# Altium schematic sheet 3_LEDDRIVERS.SchDoc: SmartHalo - Led (Drivers)
size B; Author: Sébastien Gélinas; Organization: SmartHalo; Address1: 5445 de Gaspé; Address2: Montréal, QC; Address3: Canada; Address4: H2T 3B2; Revision: 1; SheetNumber: 3; SheetTotal: 7
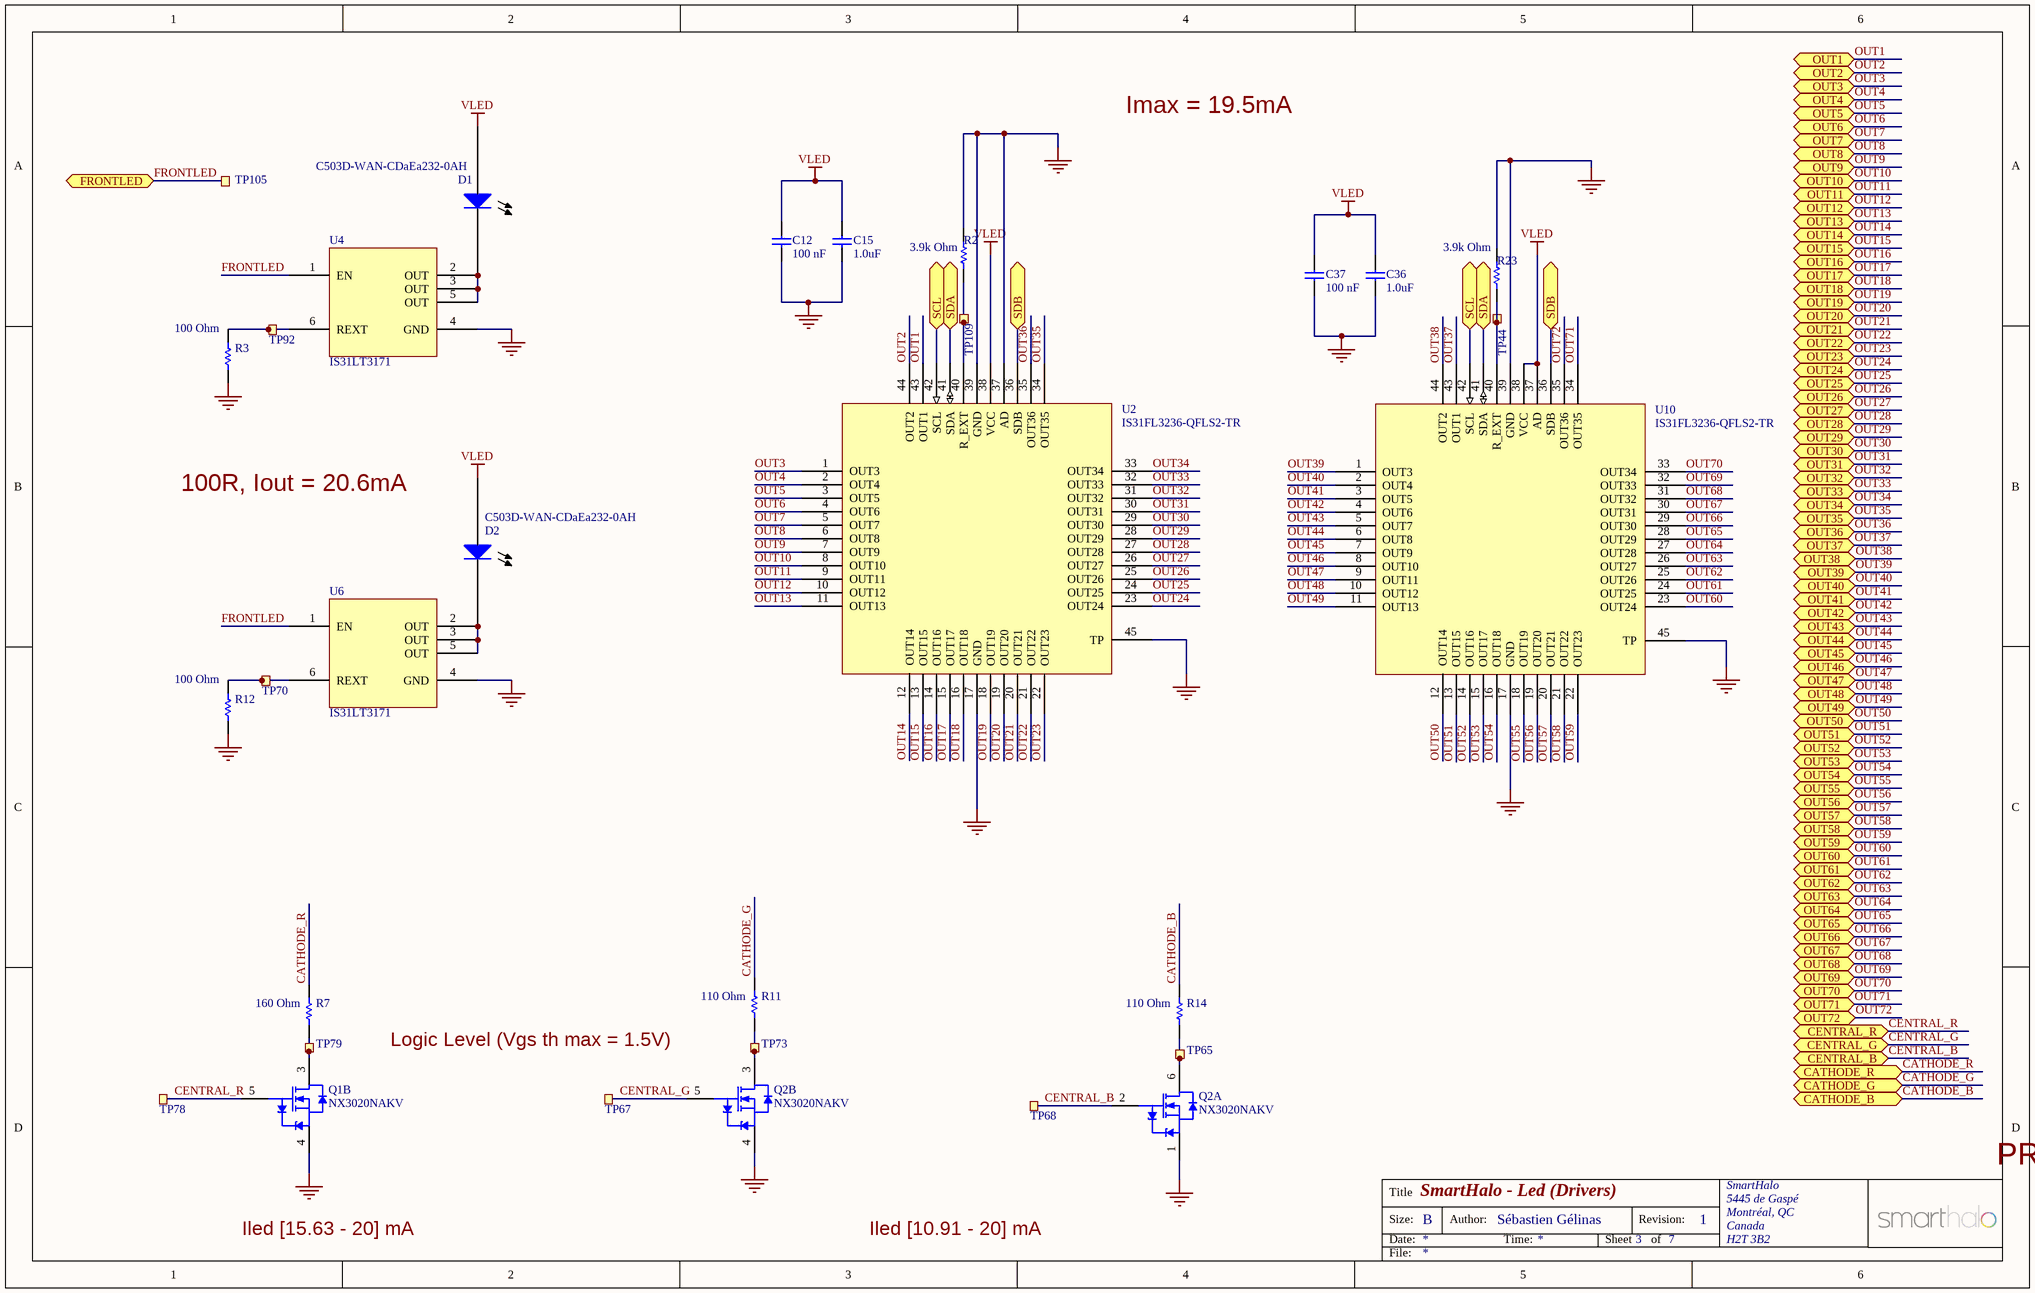
[diagram p0: 3_LEDDRIVERS.SchDoc]

## Parts
C12  100 nF  [Varitron_CAP0402]
C15  1.0uF  [Varitron_CAP0603]
C36  1.0uF  [Varitron_CAP0603]
C37  100 nF  [Varitron_CAP0402]
D1  C503D-WAN-CDaEa232-0AH  [FRONTLED_PADS]
D2  C503D-WAN-CDaEa232-0AH  [FRONTLED_PADS]
Q1  NX3020NAKV  [SOT666]  (part B of 2)
Q2  NX3020NAKV  [SOT666]  (parts A,B of 2)
R2  3.9k Ohm  [Varitron_RES0402]
R3  100 Ohm  [Varitron_RES0402]
R7  160 Ohm  [Varitron_RES0402]
R11  110 Ohm  [Varitron_RES0402]
R12  100 Ohm  [Varitron_RES0402]
R14  110 Ohm  [Varitron_RES0402]
R23  3.9k Ohm  [Varitron_RES0402]
TP44  (no value)  [TESTPAD-TH-35mils]  (no BOM)
TP65  (no value)  [TESTPAD-TH-35mils]  (no BOM)
TP67  (no value)  [TESTPAD-TH-35mils]  (no BOM)
TP68  (no value)  [TESTPAD-TH-35mils]  (no BOM)
TP70  (no value)  [TESTPAD-TH-35mils]  (no BOM)
TP73  (no value)  [TESTPAD-TH-35mils]  (no BOM)
TP78  (no value)  [TESTPAD-TH-35mils]  (no BOM)
TP79  (no value)  [TESTPAD-TH-35mils]  (no BOM)
TP92  (no value)  [TESTPAD-TH-35mils]  (no BOM)
TP105  (no value)  [TESTPAD-TH-35mils]  (no BOM)
TP109  (no value)  [TESTPAD-TH-35mils]  (no BOM)
U2  IS31FL3236-QFLS2-TR  [QFN-44]
U4  IS31LT3171  [SOT23-6]
U6  IS31LT3171  [SOT23-6]
U10  IS31FL3236-QFLS2-TR  [QFN-44]

## Ports
CATHODE_B, CATHODE_G, CATHODE_R, CENTRAL_B, CENTRAL_G, CENTRAL_R, FRONTLED, OUT1, OUT2, OUT3, OUT4, OUT5, OUT6, OUT7, OUT8, OUT9, OUT10, OUT11, OUT12, OUT13, OUT14, OUT15, OUT16, OUT17, OUT18, OUT19, OUT20, OUT21, OUT22, OUT23, OUT24, OUT25, OUT26, OUT27, OUT28, OUT29, OUT30, OUT31, OUT32, OUT33, OUT34, OUT35, OUT36, OUT37, OUT38, OUT39, OUT40, OUT41, OUT42, OUT43, OUT44, OUT45, OUT46, OUT47, OUT48, OUT49, OUT50, OUT51, OUT52, OUT53, OUT54, OUT55, OUT56, OUT57, OUT58, OUT59, OUT60, OUT61, OUT62, OUT63, OUT64, OUT65, OUT66, OUT67, OUT68, OUT69, OUT70, OUT71, OUT72, SCL (bidir), SDA (bidir), SDB (bidir)

## Nets
GND: C12.2 C15.2 C36.2 C37.2 Q1.4(S2) Q2.1(S1) Q2.4(S2) R2.2 R3.1 R12.1 R23.2 U2.17(GND) U2.37(AD) U2.39(GND) U2.45(TP) U4.4(GND) U6.4(GND) U10.17(GND) U10.39(GND) U10.45(TP)
VLED: C12.1 C15.1 C36.1 C37.1 D1.1(Anode) D2.1(Anode) U2.38(VCC) U10.37(AD) U10.38(VCC)
CATHODE_B: R14.2 ; port CATHODE_B
CATHODE_G: R11.2 ; port CATHODE_G
CATHODE_R: R7.2 ; port CATHODE_R
CENTRAL_B: Q2.2(G1) TP68.1 ; port CENTRAL_B
CENTRAL_G: Q2.5(G2) TP67.1 ; port CENTRAL_G
CENTRAL_R: Q1.5(G2) TP78.1 ; port CENTRAL_R
FRONTLED: TP105.1 U4.1(EN) U6.1(EN) ; port FRONTLED
OUT1: U2.43(OUT1) ; port OUT1
OUT2: U2.44(OUT2) ; port OUT2
OUT3: U2.1(OUT3) ; port OUT3
OUT4: U2.2(OUT4) ; port OUT4
OUT5: U2.3(OUT5) ; port OUT5
OUT6: U2.4(OUT6) ; port OUT6
OUT7: U2.5(OUT7) ; port OUT7
OUT8: U2.6(OUT8) ; port OUT8
OUT9: U2.7(OUT9) ; port OUT9
OUT10: U2.8(OUT10) ; port OUT10
OUT11: U2.9(OUT11) ; port OUT11
OUT12: U2.10(OUT12) ; port OUT12
OUT13: U2.11(OUT13) ; port OUT13
OUT14: U2.12(OUT14) ; port OUT14
OUT15: U2.13(OUT15) ; port OUT15
OUT16: U2.14(OUT16) ; port OUT16
OUT17: U2.15(OUT17) ; port OUT17
OUT18: U2.16(OUT18) ; port OUT18
OUT19: U2.18(OUT19) ; port OUT19
OUT20: U2.19(OUT20) ; port OUT20
OUT21: U2.20(OUT21) ; port OUT21
OUT22: U2.21(OUT22) ; port OUT22
OUT23: U2.22(OUT23) ; port OUT23
OUT24: U2.23(OUT24) ; port OUT24
OUT25: U2.24(OUT25) ; port OUT25
OUT26: U2.25(OUT26) ; port OUT26
OUT27: U2.26(OUT27) ; port OUT27
OUT28: U2.27(OUT28) ; port OUT28
OUT29: U2.28(OUT29) ; port OUT29
OUT30: U2.29(OUT30) ; port OUT30
OUT31: U2.30(OUT31) ; port OUT31
OUT32: U2.31(OUT32) ; port OUT32
OUT33: U2.32(OUT33) ; port OUT33
OUT34: U2.33(OUT34) ; port OUT34
OUT35: U2.34(OUT35) ; port OUT35
OUT36: U2.35(OUT36) ; port OUT36
OUT37: U10.43(OUT1) ; port OUT37
OUT38: U10.44(OUT2) ; port OUT38
OUT39: U10.1(OUT3) ; port OUT39
OUT40: U10.2(OUT4) ; port OUT40
OUT41: U10.3(OUT5) ; port OUT41
OUT42: U10.4(OUT6) ; port OUT42
OUT43: U10.5(OUT7) ; port OUT43
OUT44: U10.6(OUT8) ; port OUT44
OUT45: U10.7(OUT9) ; port OUT45
OUT46: U10.8(OUT10) ; port OUT46
OUT47: U10.9(OUT11) ; port OUT47
OUT48: U10.10(OUT12) ; port OUT48
OUT49: U10.11(OUT13) ; port OUT49
OUT50: U10.12(OUT14) ; port OUT50
OUT51: U10.13(OUT15) ; port OUT51
OUT52: U10.14(OUT16) ; port OUT52
OUT53: U10.15(OUT17) ; port OUT53
OUT54: U10.16(OUT18) ; port OUT54
OUT55: U10.18(OUT19) ; port OUT55
OUT56: U10.19(OUT20) ; port OUT56
OUT57: U10.20(OUT21) ; port OUT57
OUT58: U10.21(OUT22) ; port OUT58
OUT59: U10.22(OUT23) ; port OUT59
OUT60: U10.23(OUT24) ; port OUT60
OUT61: U10.24(OUT25) ; port OUT61
OUT62: U10.25(OUT26) ; port OUT62
OUT63: U10.26(OUT27) ; port OUT63
OUT64: U10.27(OUT28) ; port OUT64
OUT65: U10.28(OUT29) ; port OUT65
OUT66: U10.29(OUT30) ; port OUT66
OUT67: U10.30(OUT31) ; port OUT67
OUT68: U10.31(OUT32) ; port OUT68
OUT69: U10.32(OUT33) ; port OUT69
OUT70: U10.33(OUT34) ; port OUT70
OUT71: U10.34(OUT35) ; port OUT71
OUT72: U10.35(OUT36) ; port OUT72
SCL: U2.42(SCL) U10.42(SCL) ; port SCL
SDA: U2.41(SDA) U10.41(SDA) ; port SDA
SDB: U2.36(SDB) U10.36(SDB) ; port SDB
NetD1_2: D1.2(Cathode) U4.2(OUT) U4.3(OUT) U4.5(OUT)
NetD2_2: D2.2(Cathode) U6.2(OUT) U6.3(OUT) U6.5(OUT)
NetQ1_3: Q1.3(D2) R7.1 TP79.1
NetQ2_3: Q2.3(D2) R11.1 TP73.1
NetQ2_6: Q2.6(D1) R14.1 TP65.1
NetR2_1: R2.1 TP109.1 U2.40(R_EXT)
NetR3_2: R3.2 TP92.1 U4.6(REXT)
NetR12_2: R12.2 TP70.1 U6.6(REXT)
NetR23_1: R23.1 TP44.1 U10.40(R_EXT)

## Notes on the sheet
- Imax = 19.5mA
- 100R, Iout = 20.6mA
- Logic Level (Vgs th max = 1.5V)
- PRELIMINARY: DO NOT USE FOR PRODUCTION
- Iled [15.63 - 20] mA
- Iled [10.91 - 20] mA
- Title
- Size:
- Date:
- B
- Author:
- Time:
- Sheet
- Revision:
- of
- File:

## Library data of the parts
C12 C37 = Varitron_CAP0402: 100 nF 10V X7R 10% 0402 (1005 Metric)  SMD; Case-EIA: 0402; Case-Metric: 1005; Tolerance: 10%; Technology: SMT; Temperature Coefficient: X7R; Voltage Rating: 10V; Value: 100 nF
C15 C36 = Varitron_CAP0603: 1uF 10V X7R 10% 0603 (1608 Metric)  SMD; Case-EIA: 0603; Case-Metric: 1608; Tolerance: 10%; Technology: SMT; Temperature Coefficient: X7R; Voltage Rating: 10V; Value: 1.0uF
D1 D2 = C503D-WAN-CDaEa232-0AH: Cree 5mm Round LED C503D-WAN-CDaEa232-0AH; pin to pad: A>1 C>2; Manufacturer: Cree; Manufacturer Part Number: C503D-WAN-CDaEa232-0AH; Part Number: C503D-WAN-CDaEa232-0AH
Q1 Q2 = NX3020NAKV: 30 V, 200 mA dual N-channel Trench MOSFET; Manufacturer: NXP Semiconductors; Manufacturer Part Number: NX3020NAKV; Part Number: NX3020NAKV
R2 R23 = Varitron_RES0402: 3K9 0.063W 5%  0402 (1005 Metric)  SMD; Case-Metric: 1005; Case-EIA: 0402; Tolerance: 5%; Technology: SMT; Power: 0.063W; Value: 3.9k Ohm
R3 R12 = Varitron_RES0402: 100R 0.1W 5% 0402 (1005 Metric)  SMD; Case-Metric: 1005; Case-EIA: 0402; Tolerance: 5%; Technology: SMT; Power: 0.1W; Value: 100 Ohm
R7 = Varitron_RES0402: 160R 0.1W 5% 0402 (1005 Metric)  SMD; Case-Metric: 1005; Case-EIA: 0402; Tolerance: 5%; Technology: SMT; Power: 0.1W; Value: 160 Ohm
R11 R14 = Varitron_RES0402: 110R 0.1W 5% 0402 (1005 Metric)  SMD; Case-Metric: 1005; Case-EIA: 0402; Tolerance: 5%; Technology: SMT; Power: 0.1W; Value: 110 Ohm
TP44 TP65 TP67 TP68 TP70 TP73 TP78 TP79 TP92 TP105 TP109 = TESTPAD_TH_35mils: Testpoint, through hole, 35 mils; Value: TP
U2 U10 = IS31FL3236-QFLS2-TR: IC 36 CHANNELS LED DRIVER; Manufacturer: ISSI; Manufacturer Part Number: IS31FL3236-QFLS2-TR; Part Number: IS31FL3236-QFLS2-TR
U4 U6 = IS31LT3171: 10-TO-150MA CONSTANT-CURRENT LED DRIVER; Manufacturer: ISSI; Manufacturer Part Number: IS31LT3171; Part Number: IS31LT3171